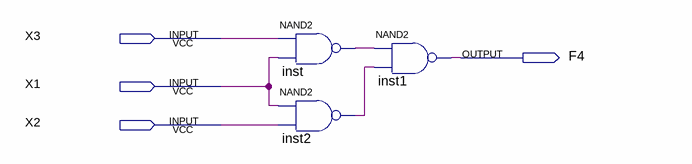
[diagram p0: schematic sheet]
// Quartus schematic block_name.bdf as structural Verilog: 3 symbols, 4 pins
module block_name (
  input  X3,
  input  X1,
  input  X2,
  output F4
);

  wire inst2_out, inst_out;

  nand inst (inst_out, X3, X1);
  nand inst2 (inst2_out, X1, X2);
  nand inst1 (F4, inst_out, inst2_out);
endmodule
